# Altium schematic sheet usb3_plug_to_picoblade.SchDoc
size A4
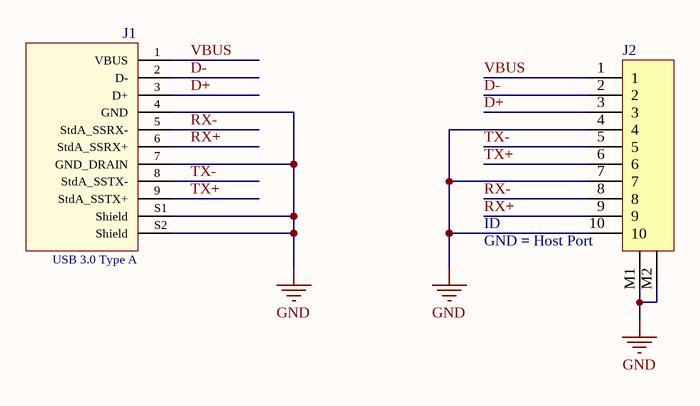
[diagram p0: usb3_plug_to_picoblade.SchDoc]

## Parts
J1  USB 3.0 Type A  [692112030100]
J2  HEADER-10  [PICOBLADE-10-SMD]  (value not drawn)

## Nets
GND: J1.4(GND) J1.7(GND_DRAIN) J1.S1(Shield) J1.S2(Shield) J2.4 J2.7 J2.10 J2.M1(M2) J2.M2
D+: J1.3(D+) J2.3
D-: J1.2(D-) J2.2
RX+: J1.6(StdA_SSRX+) J2.9
RX-: J1.5(StdA_SSRX-) J2.8
TX+: J1.9(StdA_SSTX+) J2.6
TX-: J1.8(StdA_SSTX-) J2.5
VBUS: J1.1(VBUS) J2.1

## Notes on the sheet
- ID
- (near J2) GND = Host Port

## Library data of the parts
J1 = 692112030100: USB 3.0 Type A Horizontal SMT Plug with Clip WR-COM; Rated Current: 0.25 A; Gender: Male; ComponentLink1Description: Manufacturer; ComponentLink1URL: http://www.we-online.de; ComponentLink2Description: Datasheet; ComponentLink2URL: http://katalog.we-online.de/em/datasheet/692112030100.pdf; Part Number: 692112030100; Published Date: May 2018; Publisher: Wurth Elektronik; Orientation: Horizontal; Interface Type: USB 3.0 Type A; Operating Temperature: -20 to 85 degC; Mounting Technology: SMT; Packaging: Tray
J2 = PICOBLADE-10-SMD